# Altium project Kasli-SOC.PrjPcb (part 1 of 11)
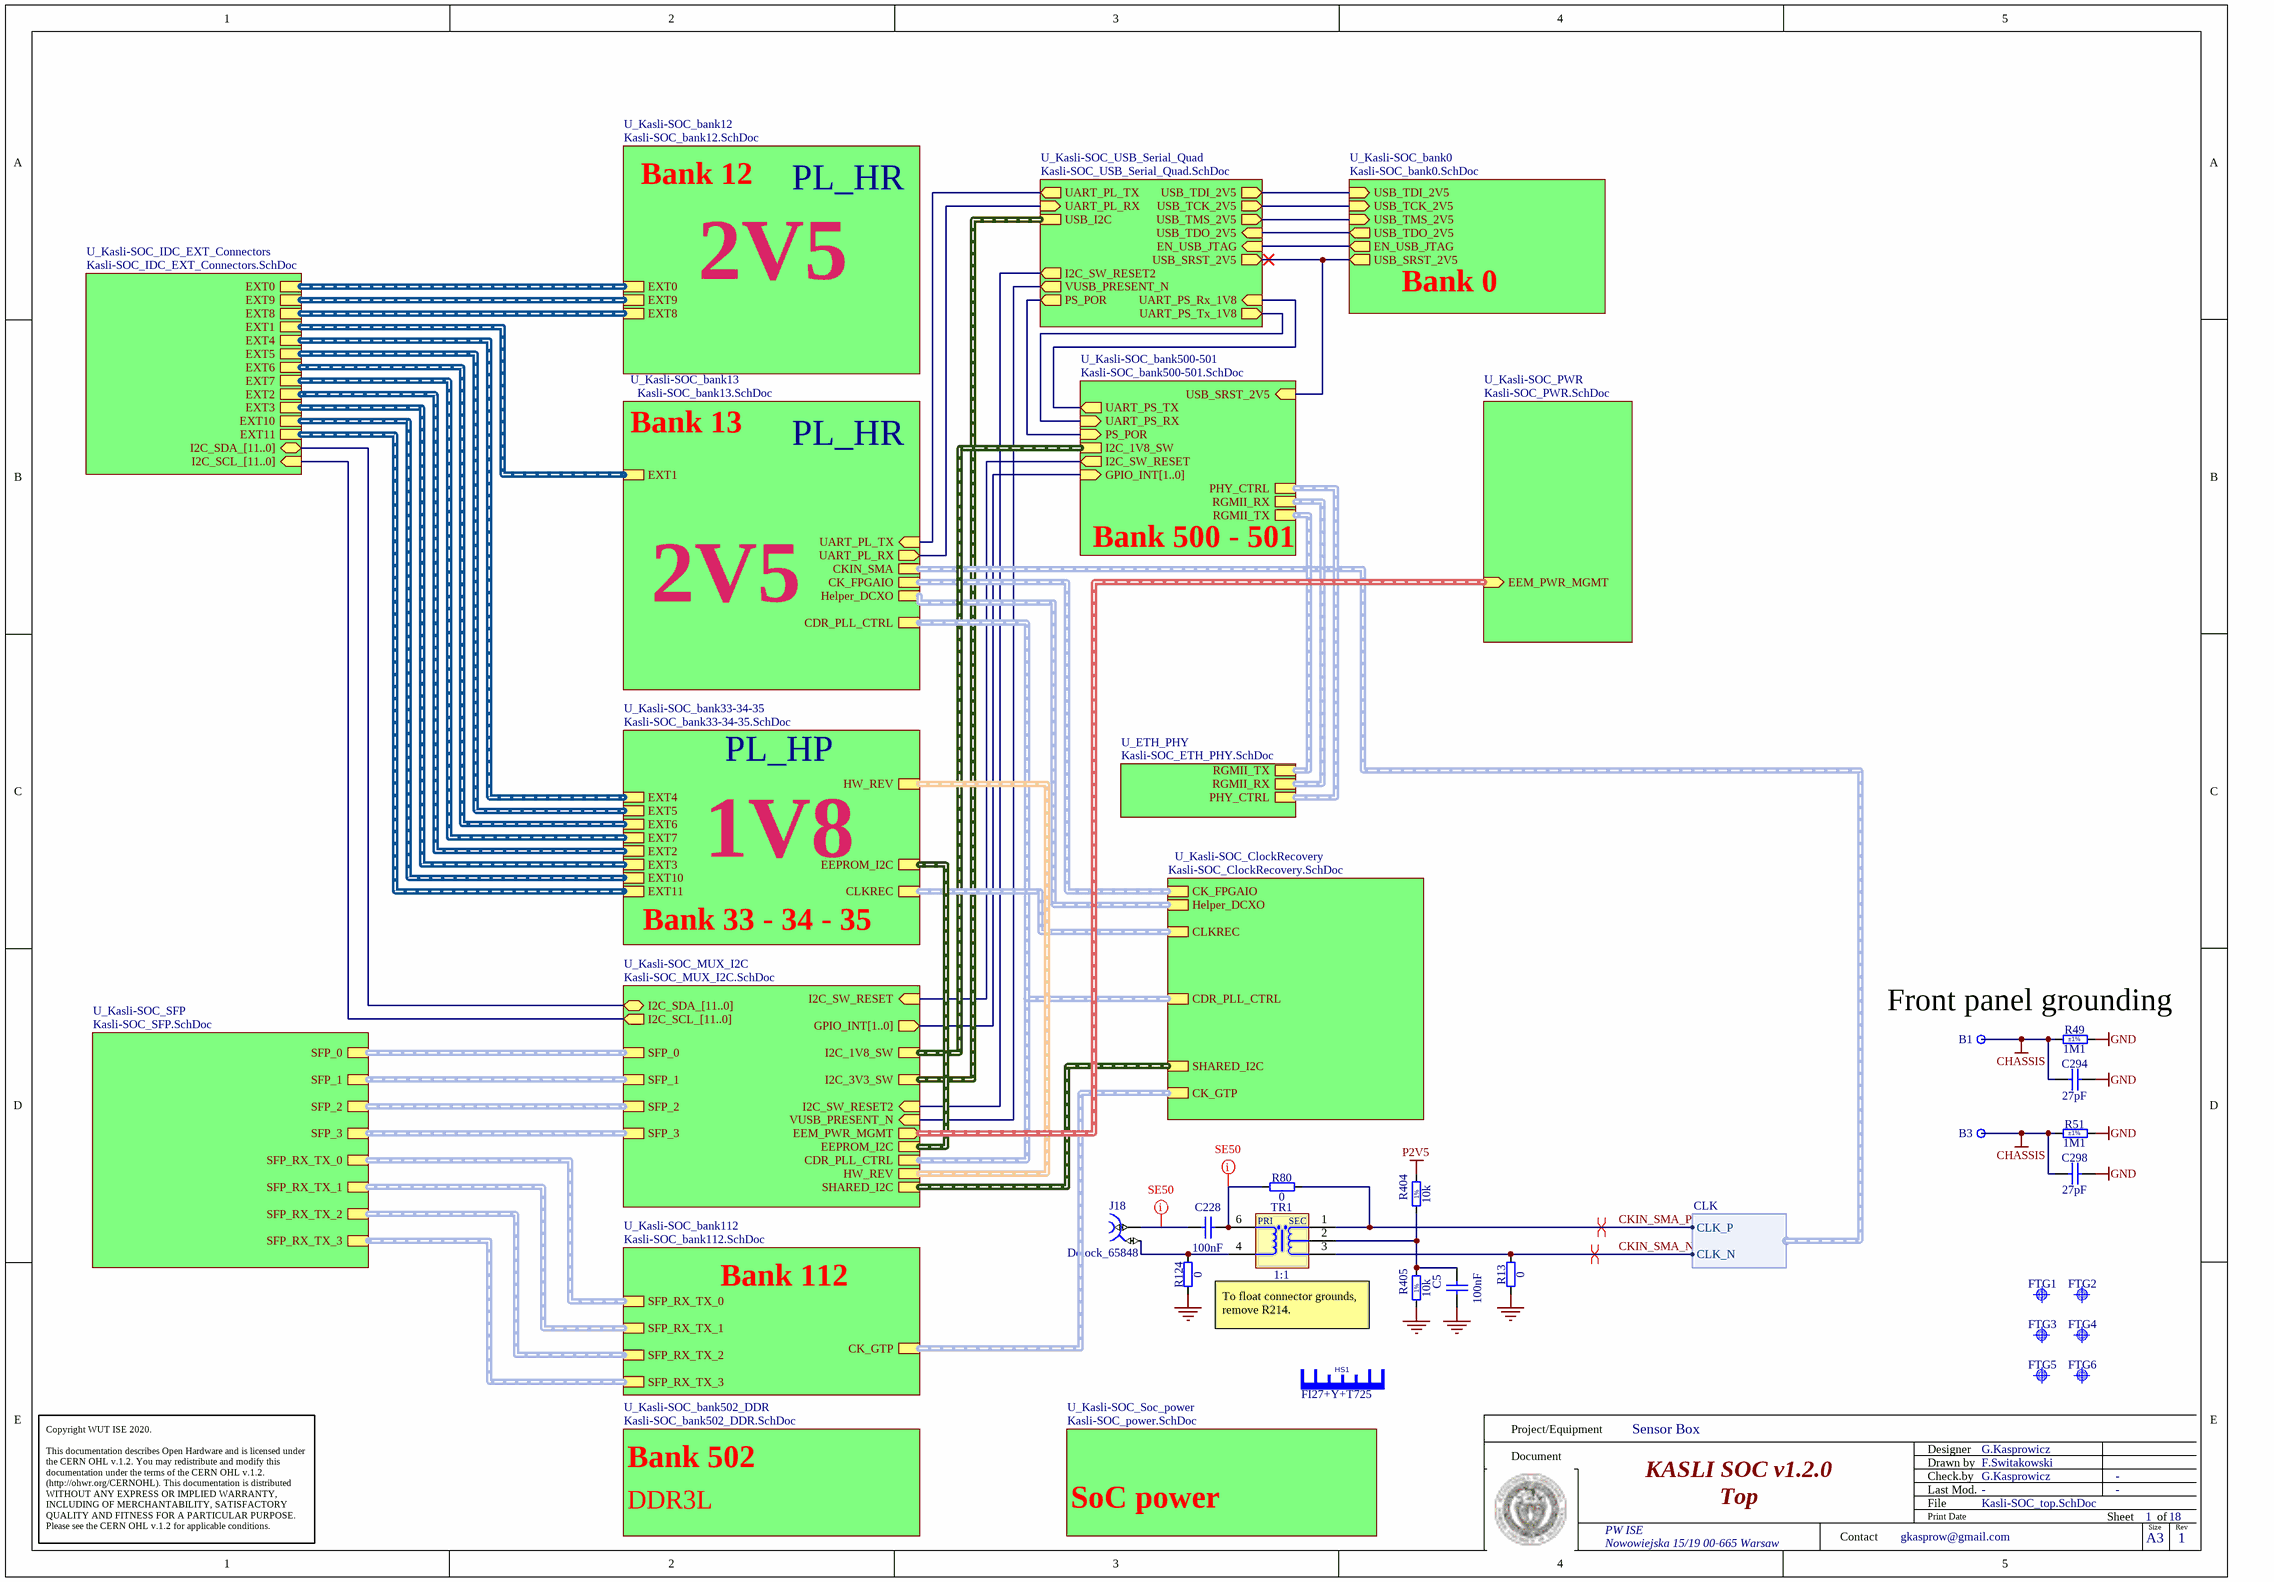
[diagram p0: Kasli-SOC_top.SchDoc]
P_version: 1.2.1
18 sheets, 964 parts. Net scope: hierarchical (ports join the sheet entries above them; power ports are global).
Board file: Kasli-SOC.PCBDOC
Sheets:
  Kasli-SOC_top.SchDoc
    U_Kasli-SOC_bank12 = Kasli-SOC_bank12.SchDoc
    U_Kasli-SOC_bank33-34-35 = Kasli-SOC_bank33-34-35.SchDoc
    U_Kasli-SOC_Soc_power = Kasli-SOC_power.SchDoc
    U_Kasli-SOC_bank112 = Kasli-SOC_bank112.SchDoc
    U_Kasli-SOC_bank500-501 = Kasli-SOC_bank500-501.SchDoc
    U_Kasli-SOC_bank502_DDR = Kasli-SOC_bank502_DDR.SchDoc
    U_Kasli-SOC_bank13 = Kasli-SOC_bank13.SchDoc
    U_Kasli-SOC_IDC_EXT_Connectors = Kasli-SOC_IDC_EXT_Connectors.SchDoc
    U_Kasli-SOC_SFP = Kasli-SOC_SFP.SchDoc
    U_Kasli-SOC_MUX_I2C = Kasli-SOC_MUX_I2C.SchDoc
    U_Kasli-SOC_ClockRecovery = Kasli-SOC_ClockRecovery.SchDoc
    U_Kasli-SOC_USB_Serial_Quad = Kasli-SOC_USB_Serial_Quad.SchDoc
    U_Kasli-SOC_PWR = Kasli-SOC_PWR.SchDoc
      U_Kasli_SOC_QUAD_BUCK = Kasli-SOC_QUAD_BUCK.SchDoc
      U_Kasli-SOC_linear = Kasli-SOC_linear.SchDoc
    U_Kasli-SOC_bank0 = Kasli-SOC_bank0.SchDoc
    U_ETH_PHY = Kasli-SOC_ETH_PHY.SchDoc

## Sheet Kasli-SOC_top.SchDoc: KASLI SOC v1.2.0
size 420 x 297 mm; Projet: FPGA & ARM SoC FMC Carrier; CheckedBy: G.Kasprowicz; Author: F.Switakowski; CompanyName: WUT ISE; DrawnBy: F.Switakowski; Organization: WUT ISE; Address1: PW ISE; Address2: Nowowiejska 15/19 00-665 Warsaw; Address3: gkasprow@gmail.com; DocumentNumber: 1; Revision: 1; SheetNumber: 1; SheetTotal: 18; ModifiedBy: -; CheckedDate: -; Title2: Top; DivGrp: WUT ISE; Designer: G.Kasprowicz; ModifiedDate: -; ProjectName: Sensor Box

### Parts
B1  Plated Hole  [MTG270_500]  (value not drawn)  (no BOM)
B3  Plated Hole  [MTG270_500]  (value not drawn)  (no BOM)
C5  100nF  [CAPC0603X33N]
C228  100nF  [CAPC0603X33N]
C294  27pF  [CAPC2012X135N]
C298  27pF  [CAPC2012X135N]
FTG1  Use only in PCB  [FIDUCIAL_TOP_S100-200]  (value not drawn)  (no BOM)
FTG2  Use only in PCB  [FIDUCIAL_TOP_S100-200]  (value not drawn)  (no BOM)
FTG3  Use only in PCB  [FIDUCIAL_TOP_S100-200]  (value not drawn)  (no BOM)
FTG4  Use only in PCB  [FIDUCIAL_TOP_S100-200]  (value not drawn)  (no BOM)
FTG5  Use only in PCB  [FIDUCIAL_TOP_S100-200]  (value not drawn)  (no BOM)
FTG6  Use only in PCB  [FIDUCIAL_TOP_S100-200]  (value not drawn)  (no BOM)
HS1  Manufacturer Part Number: FI27+Y+T725  (hidden comment: RADIAN_FI27+Y+T725)  (mechanical)
J18  Delock_65848  [Delock_65848]
R13  0  [RESC1005X40N]
R49  1M1  Tolerance: ±1%  [RESC1608X55N]
R51  1M1  Tolerance: ±1%  [RESC1608X55N]
R80  0  [RESC1005X40N]
R124  0  [RESC1005X40N]
R404  10k  [RESC1005X40N]
R405  10k  [RESC1005X40N]
TR1  1:1  [XFMR_MINI-CIRCUITS_AT1521]

### Sub-sheets
U_ETH_PHY = Kasli-SOC_ETH_PHY.SchDoc: RGMII_TX (harness RGMII), RGMII_RX (harness RGMII), PHY_CTRL (harness PHY_CTRL)
U_Kasli-SOC_bank0 = Kasli-SOC_bank0.SchDoc: USB_TDI_2V5 (in), USB_TCK_2V5 (in), USB_TMS_2V5 (in), USB_TDO_2V5 (out), EN_USB_JTAG (out), USB_SRST_2V5 (out)
U_Kasli-SOC_bank12 = Kasli-SOC_bank12.SchDoc: EXT0 (harness ExtensionConnector), EXT9 (harness ExtensionConnector), EXT8 (harness ExtensionConnector)
U_Kasli-SOC_bank13 = Kasli-SOC_bank13.SchDoc: CDR_PLL_CTRL (harness CDR_PLL_CTRL), EXT1 (harness ExtensionConnector), CK_FPGAIO (harness CLK), Helper_DCXO (harness CLK), CKIN_SMA (harness CLK), UART_PL_TX (in), UART_PL_RX (out)
U_Kasli-SOC_bank33-34-35 = Kasli-SOC_bank33-34-35.SchDoc: EXT6 (harness ExtensionConnector), EXT7 (harness ExtensionConnector), EXT2 (harness ExtensionConnector), EXT3 (harness ExtensionConnector), EXT10 (harness ExtensionConnector), EXT11 (harness ExtensionConnector), EXT5 (harness ExtensionConnector), EXT4 (harness ExtensionConnector), CLKREC (harness CLK), EEPROM_I2C (harness I2C), HW_REV (harness HW_REV)
U_Kasli-SOC_bank112 = Kasli-SOC_bank112.SchDoc: SFP_RX_TX_0 (harness SFP_RX_TX), SFP_RX_TX_1 (harness SFP_RX_TX), SFP_RX_TX_2 (harness SFP_RX_TX), SFP_RX_TX_3 (harness SFP_RX_TX), CK_GTP (harness CLK)
U_Kasli-SOC_bank500-501 = Kasli-SOC_bank500-501.SchDoc: UART_PS_RX (in), UART_PS_TX (out), PS_POR (in), USB_SRST_2V5 (in), GPIO_INT[1..0] (in), I2C_SW_RESET (out), I2C_1V8_SW (harness I2C), RGMII_RX (harness RGMII), RGMII_TX (harness RGMII), PHY_CTRL (harness PHY_CTRL)
U_Kasli-SOC_bank502_DDR = Kasli-SOC_bank502_DDR.SchDoc: no entries
U_Kasli-SOC_ClockRecovery = Kasli-SOC_ClockRecovery.SchDoc: CDR_PLL_CTRL (harness CDR_PLL_CTRL), SHARED_I2C (harness I2C), CK_GTP (harness CLK), CK_FPGAIO (harness CLK), Helper_DCXO (harness CLK), CLKREC (harness CLK)
U_Kasli-SOC_IDC_EXT_Connectors = Kasli-SOC_IDC_EXT_Connectors.SchDoc: EXT0 (harness ExtensionConnector), EXT4 (harness ExtensionConnector), EXT8 (harness ExtensionConnector), EXT9 (harness ExtensionConnector), EXT1 (harness ExtensionConnector), EXT7 (harness ExtensionConnector), EXT6 (harness ExtensionConnector), EXT5 (harness ExtensionConnector), EXT2 (harness ExtensionConnector), EXT3 (harness ExtensionConnector), EXT10 (harness ExtensionConnector), EXT11 (harness ExtensionConnector), I2C_SDA_[11..0] (bidir), I2C_SCL_[11..0] (in)
U_Kasli-SOC_MUX_I2C = Kasli-SOC_MUX_I2C.SchDoc: SFP_0 (harness SFP), SFP_1 (harness SFP), SFP_2 (harness SFP), SFP_3 (harness SFP), I2C_SW_RESET (in), I2C_SW_RESET2 (in), CDR_PLL_CTRL (harness CDR_PLL_CTRL), VUSB_PRESENT_N (in), GPIO_INT[1..0] (out), I2C_3V3_SW (harness I2C), I2C_1V8_SW (harness I2C), SHARED_I2C (harness I2C), I2C_SDA_[11..0] (bidir), I2C_SCL_[11..0] (out), EEPROM_I2C (harness I2C), HW_REV (harness HW_REV), EEM_PWR_MGMT (out)
U_Kasli-SOC_PWR = Kasli-SOC_PWR.SchDoc: EEM_PWR_MGMT (in)
U_Kasli-SOC_SFP = Kasli-SOC_SFP.SchDoc: SFP_RX_TX_0 (harness SFP_RX_TX), SFP_RX_TX_1 (harness SFP_RX_TX), SFP_RX_TX_2 (harness SFP_RX_TX), SFP_RX_TX_3 (harness SFP_RX_TX), SFP_0 (harness SFP), SFP_1 (harness SFP), SFP_2 (harness SFP), SFP_3 (harness SFP)
U_Kasli-SOC_Soc_power = Kasli-SOC_power.SchDoc: no entries
U_Kasli-SOC_USB_Serial_Quad = Kasli-SOC_USB_Serial_Quad.SchDoc: USB_TDI_2V5 (out), USB_TCK_2V5 (out), USB_TMS_2V5 (out), USB_TDO_2V5 (in), EN_USB_JTAG (in), I2C_SW_RESET2 (out), UART_PS_Rx_1V8 (in), UART_PS_Tx_1V8 (out), VUSB_PRESENT_N (out), USB_I2C (harness I2C), UART_PL_RX (in), UART_PL_TX (out), USB_SRST_2V5 (out), PS_POR (out)

### Harnesses
CLK: CLK_P, CLK_N

### Nets
CHASSIS: B1.1 B3.1 C294.1 C298.1 R49.1 R51.1
GND: C5.1 C294.2 C298.2 R13.1 R49.2 R51.2 R124.1 R405.1
P2V5: R404.2
CKIN_SMA_N: R13.2 TR1.3(S) ; sheet U_Kasli-SOC_bank13/CKIN_SMA.CLK_N
CKIN_SMA_P: R80.2 TR1.1(SDOT) ; sheet U_Kasli-SOC_bank13/CKIN_SMA.CLK_P
EN_USB_JTAG: sheet U_Kasli-SOC_USB_Serial_Quad/EN_USB_JTAG, sheet U_Kasli-SOC_bank0/EN_USB_JTAG
I2C_SW_RESET: sheet U_Kasli-SOC_bank500-501/I2C_SW_RESET, sheet U_Kasli-SOC_MUX_I2C/I2C_SW_RESET
I2C_SW_RESET2: sheet U_Kasli-SOC_MUX_I2C/I2C_SW_RESET2, sheet U_Kasli-SOC_USB_Serial_Quad/I2C_SW_RESET2
PS_POR: sheet U_Kasli-SOC_bank500-501/PS_POR, sheet U_Kasli-SOC_USB_Serial_Quad/PS_POR
UART_PL_RX: sheet U_Kasli-SOC_bank13/UART_PL_RX, sheet U_Kasli-SOC_USB_Serial_Quad/UART_PL_RX
UART_PL_TX: sheet U_Kasli-SOC_bank13/UART_PL_TX, sheet U_Kasli-SOC_USB_Serial_Quad/UART_PL_TX
UART_PS_RX: sheet U_Kasli-SOC_bank500-501/UART_PS_RX, sheet U_Kasli-SOC_USB_Serial_Quad/UART_PS_Tx_1V8
UART_PS_Rx_1V8: sheet U_Kasli-SOC_bank500-501/UART_PS_TX, sheet U_Kasli-SOC_USB_Serial_Quad/UART_PS_Rx_1V8
USB_SRST_2V5: sheet U_Kasli-SOC_bank500-501/USB_SRST_2V5, sheet U_Kasli-SOC_USB_Serial_Quad/USB_SRST_2V5, sheet U_Kasli-SOC_bank0/USB_SRST_2V5
USB_TCK_2V5: sheet U_Kasli-SOC_USB_Serial_Quad/USB_TCK_2V5, sheet U_Kasli-SOC_bank0/USB_TCK_2V5
USB_TDI_2V5: sheet U_Kasli-SOC_USB_Serial_Quad/USB_TDI_2V5, sheet U_Kasli-SOC_bank0/USB_TDI_2V5
USB_TDO_2V5: sheet U_Kasli-SOC_USB_Serial_Quad/USB_TDO_2V5, sheet U_Kasli-SOC_bank0/USB_TDO_2V5
USB_TMS_2V5: sheet U_Kasli-SOC_USB_Serial_Quad/USB_TMS_2V5, sheet U_Kasli-SOC_bank0/USB_TMS_2V5
VUSB_PRESENT_N: sheet U_Kasli-SOC_MUX_I2C/VUSB_PRESENT_N, sheet U_Kasli-SOC_USB_Serial_Quad/VUSB_PRESENT_N
NetC5_2: C5.2 R404.1 R405.2 TR1.2(NC)
NetC228_1: C228.1 J18.1
NetC228_2: C228.2 R80.1 TR1.6(PDOT)
NetJ18_2: J18.2 R124.2 TR1.4(P)

### Buses and harness runs
bus sheet U_Kasli-SOC_bank500-501/GPIO_INT[1..0] = sheet U_Kasli-SOC_MUX_I2C/GPIO_INT[1..0]
bus sheet U_Kasli-SOC_IDC_EXT_Connectors/I2C_SCL_[11..0] = sheet U_Kasli-SOC_MUX_I2C/I2C_SCL_[11..0]
bus sheet U_Kasli-SOC_IDC_EXT_Connectors/I2C_SDA_[11..0] = sheet U_Kasli-SOC_MUX_I2C/I2C_SDA_[11..0]
harness sheet U_ETH_PHY/PHY_CTRL = sheet U_Kasli-SOC_bank500-501/PHY_CTRL
harness sheet U_ETH_PHY/RGMII_RX = sheet U_Kasli-SOC_bank500-501/RGMII_RX
harness sheet U_ETH_PHY/RGMII_TX = sheet U_Kasli-SOC_bank500-501/RGMII_TX
harness sheet U_Kasli-SOC_bank12/EXT0 = sheet U_Kasli-SOC_IDC_EXT_Connectors/EXT0
harness sheet U_Kasli-SOC_bank12/EXT8 = sheet U_Kasli-SOC_IDC_EXT_Connectors/EXT8
harness sheet U_Kasli-SOC_bank12/EXT9 = sheet U_Kasli-SOC_IDC_EXT_Connectors/EXT9
harness sheet U_Kasli-SOC_bank13/CDR_PLL_CTRL = sheet U_Kasli-SOC_ClockRecovery/CDR_PLL_CTRL = sheet U_Kasli-SOC_MUX_I2C/CDR_PLL_CTRL
harness sheet U_Kasli-SOC_bank13/CK_FPGAIO = sheet U_Kasli-SOC_ClockRecovery/CK_FPGAIO
harness sheet U_Kasli-SOC_bank13/EXT1 = sheet U_Kasli-SOC_IDC_EXT_Connectors/EXT1
harness sheet U_Kasli-SOC_bank13/Helper_DCXO = sheet U_Kasli-SOC_ClockRecovery/Helper_DCXO
harness sheet U_Kasli-SOC_bank33-34-35/CLKREC = sheet U_Kasli-SOC_ClockRecovery/CLKREC
harness sheet U_Kasli-SOC_bank33-34-35/EEPROM_I2C = sheet U_Kasli-SOC_MUX_I2C/EEPROM_I2C
harness sheet U_Kasli-SOC_bank33-34-35/EXT2 = sheet U_Kasli-SOC_IDC_EXT_Connectors/EXT2
harness sheet U_Kasli-SOC_bank33-34-35/EXT3 = sheet U_Kasli-SOC_IDC_EXT_Connectors/EXT3
harness sheet U_Kasli-SOC_bank33-34-35/EXT4 = sheet U_Kasli-SOC_IDC_EXT_Connectors/EXT4
harness sheet U_Kasli-SOC_bank33-34-35/EXT5 = sheet U_Kasli-SOC_IDC_EXT_Connectors/EXT5
harness sheet U_Kasli-SOC_bank33-34-35/EXT6 = sheet U_Kasli-SOC_IDC_EXT_Connectors/EXT6
harness sheet U_Kasli-SOC_bank33-34-35/EXT7 = sheet U_Kasli-SOC_IDC_EXT_Connectors/EXT7
harness sheet U_Kasli-SOC_bank33-34-35/EXT10 = sheet U_Kasli-SOC_IDC_EXT_Connectors/EXT10
harness sheet U_Kasli-SOC_bank33-34-35/EXT11 = sheet U_Kasli-SOC_IDC_EXT_Connectors/EXT11
harness sheet U_Kasli-SOC_bank33-34-35/HW_REV = sheet U_Kasli-SOC_MUX_I2C/HW_REV
harness sheet U_Kasli-SOC_bank112/CK_GTP = sheet U_Kasli-SOC_ClockRecovery/CK_GTP
harness sheet U_Kasli-SOC_bank112/SFP_RX_TX_0 = sheet U_Kasli-SOC_SFP/SFP_RX_TX_0
harness sheet U_Kasli-SOC_bank112/SFP_RX_TX_1 = sheet U_Kasli-SOC_SFP/SFP_RX_TX_1
harness sheet U_Kasli-SOC_bank112/SFP_RX_TX_2 = sheet U_Kasli-SOC_SFP/SFP_RX_TX_2
harness sheet U_Kasli-SOC_bank112/SFP_RX_TX_3 = sheet U_Kasli-SOC_SFP/SFP_RX_TX_3
harness sheet U_Kasli-SOC_bank500-501/I2C_1V8_SW = sheet U_Kasli-SOC_MUX_I2C/I2C_1V8_SW
harness sheet U_Kasli-SOC_ClockRecovery/SHARED_I2C = sheet U_Kasli-SOC_MUX_I2C/SHARED_I2C
harness sheet U_Kasli-SOC_MUX_I2C/EEM_PWR_MGMT = sheet U_Kasli-SOC_PWR/EEM_PWR_MGMT
harness sheet U_Kasli-SOC_MUX_I2C/I2C_3V3_SW = sheet U_Kasli-SOC_USB_Serial_Quad/USB_I2C
harness sheet U_Kasli-SOC_MUX_I2C/SFP_0 = sheet U_Kasli-SOC_SFP/SFP_0
harness sheet U_Kasli-SOC_MUX_I2C/SFP_1 = sheet U_Kasli-SOC_SFP/SFP_1
harness sheet U_Kasli-SOC_MUX_I2C/SFP_2 = sheet U_Kasli-SOC_SFP/SFP_2
harness sheet U_Kasli-SOC_MUX_I2C/SFP_3 = sheet U_Kasli-SOC_SFP/SFP_3

### Layout directives
net class SE50: NetC228_1, NetC228_2
differential pair; differential pair class Diff_100Ohm: CKIN_SMA_N, CKIN_SMA_P

### Notes on the sheet
- Bank 12
- PL_HR
- 2V5
- Bank 0
- Bank 13
- Bank 500 - 501
- PL_HP
- 1V8
- Bank 33 - 34 - 35
- Front panel grounding
- Bank 112
- To float connector grounds, remove R214.
- Bank 502
- DDR3L
- SoC power
- Project/Equipment
- Document
- Designer
- Drawn by
- Check.by
- Copyright WUT ISE 2020.
  This documentation describes Open Hardware and is licensed under the CERN OHL v.1.2. You may redistribute and modify this documentation under the terms of the CERN OHL v.1.2. (http://ohwr.org/CERNOHL). This documentation is distributed WITHOUT ANY EXPRESS OR IMPLIED WARRANTY, INCLUDING OF MERCHANTABILITY, SATISFACTORY QUALITY AND FITNESS FOR A PARTICULAR PURPOSE. Please see the CERN OHL v.1.2 for applicable conditions.
- Contact
- File
- Last Mod.
- Print Date
- Sheet
- Size
- A3
- of
- Rev
- (in symbol R0402_10K_1%_0.0625W_100PPM) 1%
- (in symbol XFMR_MINI-CIRCUITS_TC2-1TX+) PRI; SEC

### Library data of the parts
B1 B3 = PLATED_HOLE2.7_PAD5.0: Single Terminal Socket; Part Description: Plated Through Hole: Hole Dia.=2.7mm Pad Dia.=5.0mm; Mounted: No; Part Number: PLATED_HOLE2.7_PAD5.0; Component Type: Standard (No BOM); Pin Count: 1; Family: Plated Hole; Socket: No; SMD: No; Sense: No; Status: None; ComponentHeight: 0mm; HelpURL: Undefined; Author: CERN DEM JMW; CreateDate: 27.09.2011; LatestRevisionDate: 27.09.2011; PackageDescription: Plated Through Hole: Hole Dia.=2.7mm Pad Dia.=5.0mm
C5 C228 = CC0201_100NF_6.3V_10%_X5R: Non-polarised capacitor; Part Description: SMD Multilayer Chip Ceramic Capacitor; Manufacturer: GENERIC; Manufacturer1 Part Number: 02016D104KAT2A; Voltage: 6.3V; TC: X5R; Tolerance: ±10%; Part Number: CC0201_100NF_6.3V_10%_X5R; Component Kind: Standard; Component Type: Standard; Pin Count: 2; Value: 100nF; Status: Not Recommended; Manufacturer Part Number: CC0201_100NF_6.3V_10%_X5R; Case: 0201; Mounted: Yes; Socket: No; SMD: Yes; Sense: No; Manufacturer1 Example: AVX; Manufacturer1 ComponentHeight: 0.33mm; HelpURL: \\cern.ch\dfs\Applications\Altium\Datasheets\CC0201_X5R_AVX.pdf; Author: CERN DEM JLC; CreateDate: 2007-12-03; LatestRevisionDate: 2007-12-03
C294 C298 = CC0805_27PF_50V_5%_NP0: Non-polarised capacitor; Part Description: SMD Multilayer Chip Ceramic Capacitor; Manufacturer: GENERIC; Manufacturer1 Part Number: 223886115279; Voltage: 50V; TC: C0G/NP0; Tolerance: ±5%; Part Number: CC0805_27PF_50V_5%_NP0; Component Kind: Standard; Component Type: Standard; Pin Count: 2; Value: 27pF; Status: Preferred; Manufacturer Part Number: CC0805_27PF_50V_5%_NP0; Case: 0805; Mounted: Yes; Socket: No; SMD: Yes; Sense: No; Manufacturer1 Example: PHYCOMP; Manufacturer1 ComponentHeight: 1.35mm; HelpURL: \\cern.ch\dfs\Applications\Altium\Datasheets\CC0805_NP0_PHYCOMP.pdf; Author: CERN DEM JLC; CreateDate: 12/3/2007; LatestRevisionDate: 12/3/2007
FTG1-FTG6 = FIDUCIAL_TARGET_S100-200: Fiducial Target; Part Description: Square Fiducial Target, Top Layer, 1.0mm, Top Solder 2.0mm, Keepout =2.0mm; Mounted: No; Part Number: FIDUCIAL_TARGET_S100-200; Component Type: Standard (No BOM); Pin Count: 1; Family: Fiducial; Socket: No; SMD: Yes; Sense: No; Status: None; ComponentHeight: 0mm; HelpURL: Undefined; Author: CERN DEM JLC; CreateDate: 09.02.2010; LatestRevisionDate: 04.04.2012; PackageDescription: Square Fiducial Target, Top Layer, 1.0mm, Top Solder 2.0mm, Keepout =2.0mm
HS1 = RADIAN_FI23: Heat Sink Without Pad; Manufacturer: Radian Thermal Products, Inc.; Part Description: 27 x 27 x 16 mm, clip on heatsink with fan for IC design BGA and others; ComponentHeight: 16 mm; HelpURL: https://www.radianheatsinks.com/product/fi23/
J18 = CMP-002-04652-1: SMA connector Delock 65848
R13 R80 R124 = R0402_0R_JUMPER: Resistor; Part Description: 1A (0.05R Max DC Resistance) Zero Ohm Jumper; Manufacturer: GENERIC; Manufacturer1 Part Number: 232270591001L; PressFit: No; Part Number: R0402_0R_JUMPER; Component Kind: Standard; Component Type: Standard; Pin Count: 2; Value: 0; Status: Not Recommended; Manufacturer Part Number: R0402_0R_JUMPER; Case: 0402; Mounted: Yes; Sense: No; Socket: No; SMD: Yes; Manufacturer1 Example: YAGEO PHYCOMP; Manufacturer1 ComponentHeight: 0.4mm; HelpURL: \\cern.ch\dfs\Applications\Altium\Datasheets\R0402_Phycomp_RC0402.pdf; Author: CERN DEM JLC; CreateDate: 03.12.2007; LatestRevisionDate: 17.10.2012
R49 R51 = R0603_1M1_1%_0.1W_100PPM: Resistor - 1%; Part Description: General Purpose Thick Film Chip Resistor; Manufacturer: GENERIC; Manufacturer1 Part Number: NRC06F1104TRF; Power: 0.1W; TC: ±100ppm/°C; PressFit: No; Part Number: R0603_1M1_1%_0.1W_100PPM; Component Kind: Standard; Component Type: Standard; Pin Count: 2; Value: 1M1; Status: Preferred; Manufacturer Part Number: R0603_1M1_1%_0.1W_100PPM; Case: 0603; Mounted: Yes; Sense: No; Socket: No; SMD: Yes; Manufacturer1 Example: NIC COMPONENT; Manufacturer1 ComponentHeight: 0.55mm; HelpURL: \\cern.ch\dfs\Applications\Altium\Datasheets\R0603_NIC_NRC.pdf; Author: CERN DEM JLC; CreateDate: 12/3/2007; LatestRevisionDate: 3/13/2008
R404 R405 = R0402_10K_1%_0.0625W_100PPM: Resistor - 1%; Part Description: General Purpose Thick Film Chip Resistor; Manufacturer: GENERIC; Manufacturer1 Part Number: 232270671003L; TC: ±100ppm/°C; PressFit: No; Part Number: R0402_10K_1%_0.0625W_100PPM; Component Kind: Standard; Component Type: Standard; Pin Count: 2; Value: 10k; Status: Not Recommended; Power: 0.0625W; Tolerance: ±1%; Manufacturer Part Number: R0402_10K_1%_0.0625W_100PPM; Case: 0402; Mounted: Yes; Sense: No; Socket: No; SMD: Yes; Manufacturer1 Example: YAGEO PHYCOMP; Manufacturer1 ComponentHeight: 0.4mm; HelpURL: \\cern.ch\dfs\Applications\Altium\Datasheets\R0402_Phycomp_RC0402.pdf; Author: CERN DEM JLC; CreateDate: 03.12.2007; LatestRevisionDate: 17.10.2012
TR1 = XFMR_MINI-CIRCUITS_TC2-1TX+: 50 Ohms 3 to 300MHz RF Transformer; Part Number: XFMR_MINI-CIRCUITS_TC2-1TX+; Component Kind: Standard; Component Type: Standard; Pin Count: 5; Value: 1:1; Status: None; Part Description: 50 Ohms 3 to 300MHz RF Transformer; Manufacturer: MINI-CIRCUITS; Manufacturer Part Number: TC2-1TX+; Mounted: Yes; Socket: No; Sense: No; SMD: Yes; ComponentHeight: 4.06mm; HelpURL: \\cern.ch\dfs\Applications\Altium\Datasheets\XFMR_MINI-CIRCUITS_TC2-1TX+.pdf; Author: CERN DEM MR; CreateDate: 18.10.2019; LatestRevisionDate: 18.10.2019

## Sheet Kasli-SOC_bank12.SchDoc: Bank12
size 420 x 297 mm; CheckedBy: G.Kasprowicz; Author: F.Switakowski; CompanyName: WUT ISE; DrawnBy: F.Switakowski; Organization: WUT ISE; Address1: PW ISE; Address2: Nowowiejska 15/19 00-665 Warsaw; Address3: gkasprow@gmail.com; DocumentNumber: 6; Revision: 1; SheetNumber: 6; SheetTotal: 18; ModifiedBy: -; CheckedDate: -; Title2: EEM LVDS; DivGrp: WUT ISE; Designer: G.Kasprowicz; ModifiedDate: -; ProjectName: Sensor Box
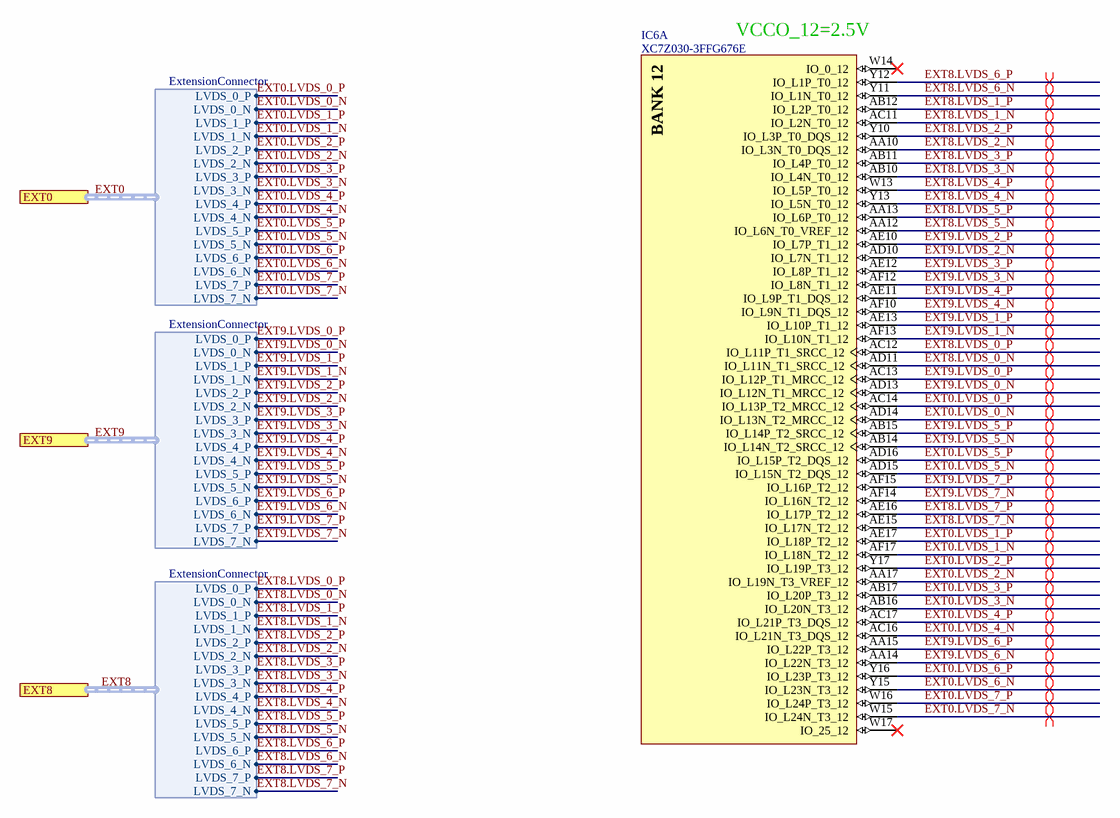
[diagram p1: Kasli-SOC_bank12.SchDoc]

### Parts
IC6  XC7Z030-3FFG676E  [BGA676C100P26X26_2700X2700X324]  (part A of 14)

### Ports
EXT0 (harness ExtensionConnector), EXT8 (harness ExtensionConnector), EXT9 (harness ExtensionConnector)

### Harnesses
ExtensionConnector: LVDS_0_N, LVDS_0_P, LVDS_1_N, LVDS_1_P, LVDS_2_N, LVDS_2_P, LVDS_3_N, LVDS_3_P, LVDS_4_N, LVDS_4_P, LVDS_5_N, LVDS_5_P, LVDS_6_N, LVDS_6_P, LVDS_7_N, LVDS_7_P

### Nets
EXT0.LVDS_0_N: IC6.AD14(IO_L13N_T2_MRCC_12) ; port EXT0.LVDS_0_N
EXT0.LVDS_0_P: IC6.AC14(IO_L13P_T2_MRCC_12) ; port EXT0.LVDS_0_P
EXT0.LVDS_1_N: IC6.AF17(IO_L18N_T2_12) ; port EXT0.LVDS_1_N
EXT0.LVDS_1_P: IC6.AE17(IO_L18P_T2_12) ; port EXT0.LVDS_1_P
EXT0.LVDS_2_N: IC6.AA17(IO_L19N_T3_VREF_12) ; port EXT0.LVDS_2_N
EXT0.LVDS_2_P: IC6.Y17(IO_L19P_T3_12) ; port EXT0.LVDS_2_P
EXT0.LVDS_3_N: IC6.AB16(IO_L20N_T3_12) ; port EXT0.LVDS_3_N
EXT0.LVDS_3_P: IC6.AB17(IO_L20P_T3_12) ; port EXT0.LVDS_3_P
EXT0.LVDS_4_N: IC6.AC16(IO_L21N_T3_DQS_12) ; port EXT0.LVDS_4_N
EXT0.LVDS_4_P: IC6.AC17(IO_L21P_T3_DQS_12) ; port EXT0.LVDS_4_P
EXT0.LVDS_5_N: IC6.AD15(IO_L15N_T2_DQS_12) ; port EXT0.LVDS_5_N
EXT0.LVDS_5_P: IC6.AD16(IO_L15P_T2_DQS_12) ; port EXT0.LVDS_5_P
EXT0.LVDS_6_N: IC6.Y15(IO_L23N_T3_12) ; port EXT0.LVDS_6_N
EXT0.LVDS_6_P: IC6.Y16(IO_L23P_T3_12) ; port EXT0.LVDS_6_P
EXT0.LVDS_7_N: IC6.W15(IO_L24N_T3_12) ; port EXT0.LVDS_7_N
EXT0.LVDS_7_P: IC6.W16(IO_L24P_T3_12) ; port EXT0.LVDS_7_P
EXT8.LVDS_0_N: IC6.AD11(IO_L11N_T1_SRCC_12) ; port EXT8.LVDS_0_N
EXT8.LVDS_0_P: IC6.AC12(IO_L11P_T1_SRCC_12) ; port EXT8.LVDS_0_P
EXT8.LVDS_1_N: IC6.AC11(IO_L2N_T0_12) ; port EXT8.LVDS_1_N
EXT8.LVDS_1_P: IC6.AB12(IO_L2P_T0_12) ; port EXT8.LVDS_1_P
EXT8.LVDS_2_N: IC6.AA10(IO_L3N_T0_DQS_12) ; port EXT8.LVDS_2_N
EXT8.LVDS_2_P: IC6.Y10(IO_L3P_T0_DQS_12) ; port EXT8.LVDS_2_P
EXT8.LVDS_3_N: IC6.AB10(IO_L4N_T0_12) ; port EXT8.LVDS_3_N
EXT8.LVDS_3_P: IC6.AB11(IO_L4P_T0_12) ; port EXT8.LVDS_3_P
EXT8.LVDS_4_N: IC6.Y13(IO_L5N_T0_12) ; port EXT8.LVDS_4_N
EXT8.LVDS_4_P: IC6.W13(IO_L5P_T0_12) ; port EXT8.LVDS_4_P
EXT8.LVDS_5_N: IC6.AA12(IO_L6N_T0_VREF_12) ; port EXT8.LVDS_5_N
EXT8.LVDS_5_P: IC6.AA13(IO_L6P_T0_12) ; port EXT8.LVDS_5_P
EXT8.LVDS_6_N: IC6.Y11(IO_L1N_T0_12) ; port EXT8.LVDS_6_N
EXT8.LVDS_6_P: IC6.Y12(IO_L1P_T0_12) ; port EXT8.LVDS_6_P
EXT8.LVDS_7_N: IC6.AE15(IO_L17N_T2_12) ; port EXT8.LVDS_7_N
EXT8.LVDS_7_P: IC6.AE16(IO_L17P_T2_12) ; port EXT8.LVDS_7_P
EXT9.LVDS_0_N: IC6.AD13(IO_L12N_T1_MRCC_12) ; port EXT9.LVDS_0_N
EXT9.LVDS_0_P: IC6.AC13(IO_L12P_T1_MRCC_12) ; port EXT9.LVDS_0_P
EXT9.LVDS_1_N: IC6.AF13(IO_L10N_T1_12) ; port EXT9.LVDS_1_N
EXT9.LVDS_1_P: IC6.AE13(IO_L10P_T1_12) ; port EXT9.LVDS_1_P
EXT9.LVDS_2_N: IC6.AD10(IO_L7N_T1_12) ; port EXT9.LVDS_2_N
EXT9.LVDS_2_P: IC6.AE10(IO_L7P_T1_12) ; port EXT9.LVDS_2_P
EXT9.LVDS_3_N: IC6.AF12(IO_L8N_T1_12) ; port EXT9.LVDS_3_N
EXT9.LVDS_3_P: IC6.AE12(IO_L8P_T1_12) ; port EXT9.LVDS_3_P
EXT9.LVDS_4_N: IC6.AF10(IO_L9N_T1_DQS_12) ; port EXT9.LVDS_4_N
EXT9.LVDS_4_P: IC6.AE11(IO_L9P_T1_DQS_12) ; port EXT9.LVDS_4_P
EXT9.LVDS_5_N: IC6.AB14(IO_L14N_T2_SRCC_12) ; port EXT9.LVDS_5_N
EXT9.LVDS_5_P: IC6.AB15(IO_L14P_T2_SRCC_12) ; port EXT9.LVDS_5_P
EXT9.LVDS_6_N: IC6.AA14(IO_L22N_T3_12) ; port EXT9.LVDS_6_N
EXT9.LVDS_6_P: IC6.AA15(IO_L22P_T3_12) ; port EXT9.LVDS_6_P
EXT9.LVDS_7_N: IC6.AF14(IO_L16N_T2_12) ; port EXT9.LVDS_7_N
EXT9.LVDS_7_P: IC6.AF15(IO_L16P_T2_12) ; port EXT9.LVDS_7_P

Not connected (* = marked no-connect by the designer): IC6 W14(IO_0_12)* W17(IO_25_12)*

### Buses and harness runs
harness EXT0 = port EXT0
harness EXT8 = port EXT8
harness EXT9 = port EXT9

### Layout directives
differential pair: EXT0.LVDS_0_N, EXT0.LVDS_0_P, EXT0.LVDS_1_N, EXT0.LVDS_1_P, EXT0.LVDS_2_N, EXT0.LVDS_2_P, EXT0.LVDS_3_N, EXT0.LVDS_3_P, EXT0.LVDS_4_N, EXT0.LVDS_4_P, EXT0.LVDS_5_N, EXT0.LVDS_5_P, EXT0.LVDS_6_N, EXT0.LVDS_6_P, EXT0.LVDS_7_N, EXT0.LVDS_7_P, EXT8.LVDS_0_N, EXT8.LVDS_0_P, EXT8.LVDS_1_N, EXT8.LVDS_1_P, EXT8.LVDS_2_N, EXT8.LVDS_2_P, EXT8.LVDS_3_N, EXT8.LVDS_3_P, EXT8.LVDS_4_N, EXT8.LVDS_4_P, EXT8.LVDS_5_N, EXT8.LVDS_5_P, EXT8.LVDS_6_N, EXT8.LVDS_6_P, EXT8.LVDS_7_N, EXT8.LVDS_7_P, EXT9.LVDS_0_N, EXT9.LVDS_0_P, EXT9.LVDS_1_N, EXT9.LVDS_1_P, EXT9.LVDS_2_N, EXT9.LVDS_2_P, EXT9.LVDS_3_N, EXT9.LVDS_3_P, EXT9.LVDS_4_N, EXT9.LVDS_4_P, EXT9.LVDS_5_N, EXT9.LVDS_5_P, EXT9.LVDS_6_N, EXT9.LVDS_6_P, EXT9.LVDS_7_N, EXT9.LVDS_7_P

### Notes on the sheet
- (near IC6) VCCO_12=2.5V
- Project/Equipment
- Document
- Designer
- Drawn by
- Check.by
- Copyright WUT ISE 2020.
  This documentation describes Open Hardware and is licensed under the CERN OHL v.1.2. You may redistribute and modify this documentation under the terms of the CERN OHL v.1.2. (http://ohwr.org/CERNOHL). This documentation is distributed WITHOUT ANY EXPRESS OR IMPLIED WARRANTY, INCLUDING OF MERCHANTABILITY, SATISFACTORY QUALITY AND FITNESS FOR A PARTICULAR PURPOSE. Please see the CERN OHL v.1.2 for applicable conditions.
- Contact
- File
- Last Mod.
- Print Date
- Sheet
- Size
- A3
- of
- Rev
- (in symbol XC7Z030-2FFG676I, part A) BANK 12

### Library data of the parts
IC6 = XC7Z030-2FFG676I: 733 MHz Zynq™-7000 AP SoC, 130 PS I/O, 254 FPGA I/O, 676-Ball BGA, Speed Grade 2, Industrial Grade, Pb-Free; Part Description: Zynq™-7000 All Programmable SoC, Dual-core ARM® Cortex™-A9 CPU, 676-Ball BGA, Speed Grade 2, Industrial Grade, Pb-Free; Manufacturer: XILINX; PressFit: No; Bonding: No; Part Number: XC7Z030-3FFG676E; Component Kind: Standard; Component Type: Standard; Device: XC7Z030-2FFG676I; PackageDescription: BGA, 1.00mm Pitch, Square; 676 Pin, 26 Columns X 26 Rows, 27.00mm X 27.00mm X 2.60mm H; Manufacturer Part Number: XC7Z030-3FFG676E; Pin Count: 676; Case: BGA676; Mounted: Yes; Socket: No; SMD: Yes; Sense: No; ComponentHeight: 3.24mm; HelpURL: \\cern.ch\dfs\Applications\Altium\Datasheets\XC7Z030-2FFG676I.pdf; ComponentLink1URL: \\cern.ch\dfs\Applications\Altium\Datasheets\XC7Z030-2FFG676I_Package.pdf; ComponentLink1Description: Package; ComponentLink2URL: \\cern.ch\dfs\Applications\Altium\Datasheets\XC7Z030-2FFG676I_Pinout.txt; ComponentLink2Description: Pinout; Author: CERN DEM JLC; CreateDate: 29/04/2014; LatestRevisionDate: 29/04/2014

## Sheet Kasli-SOC_bank33-34-35.SchDoc: Banks 33, 34, 35
size 420 x 297 mm; EDA_Number: EDA-03288-V3-0; CheckedBy: G.Kasprowicz; Author: F.Switakowski; CompanyName: WUT ISE; DrawnBy: F.Switakowski; Organization: WUT ISE; Address1: PW ISE; Address2: Nowowiejska 15/19 00-665 Warsaw; Address3: gkasprow@gmail.com; DocumentNumber: 7; Revision: 1; SheetNumber: 7; SheetTotal: 18; ModifiedBy: -; CheckedDate: -; Title2: EEM LVDS; DivGrp: WUT ISE; Designer: G.Kasprowicz; ModifiedDate: -; ProjectName: Sensor Box
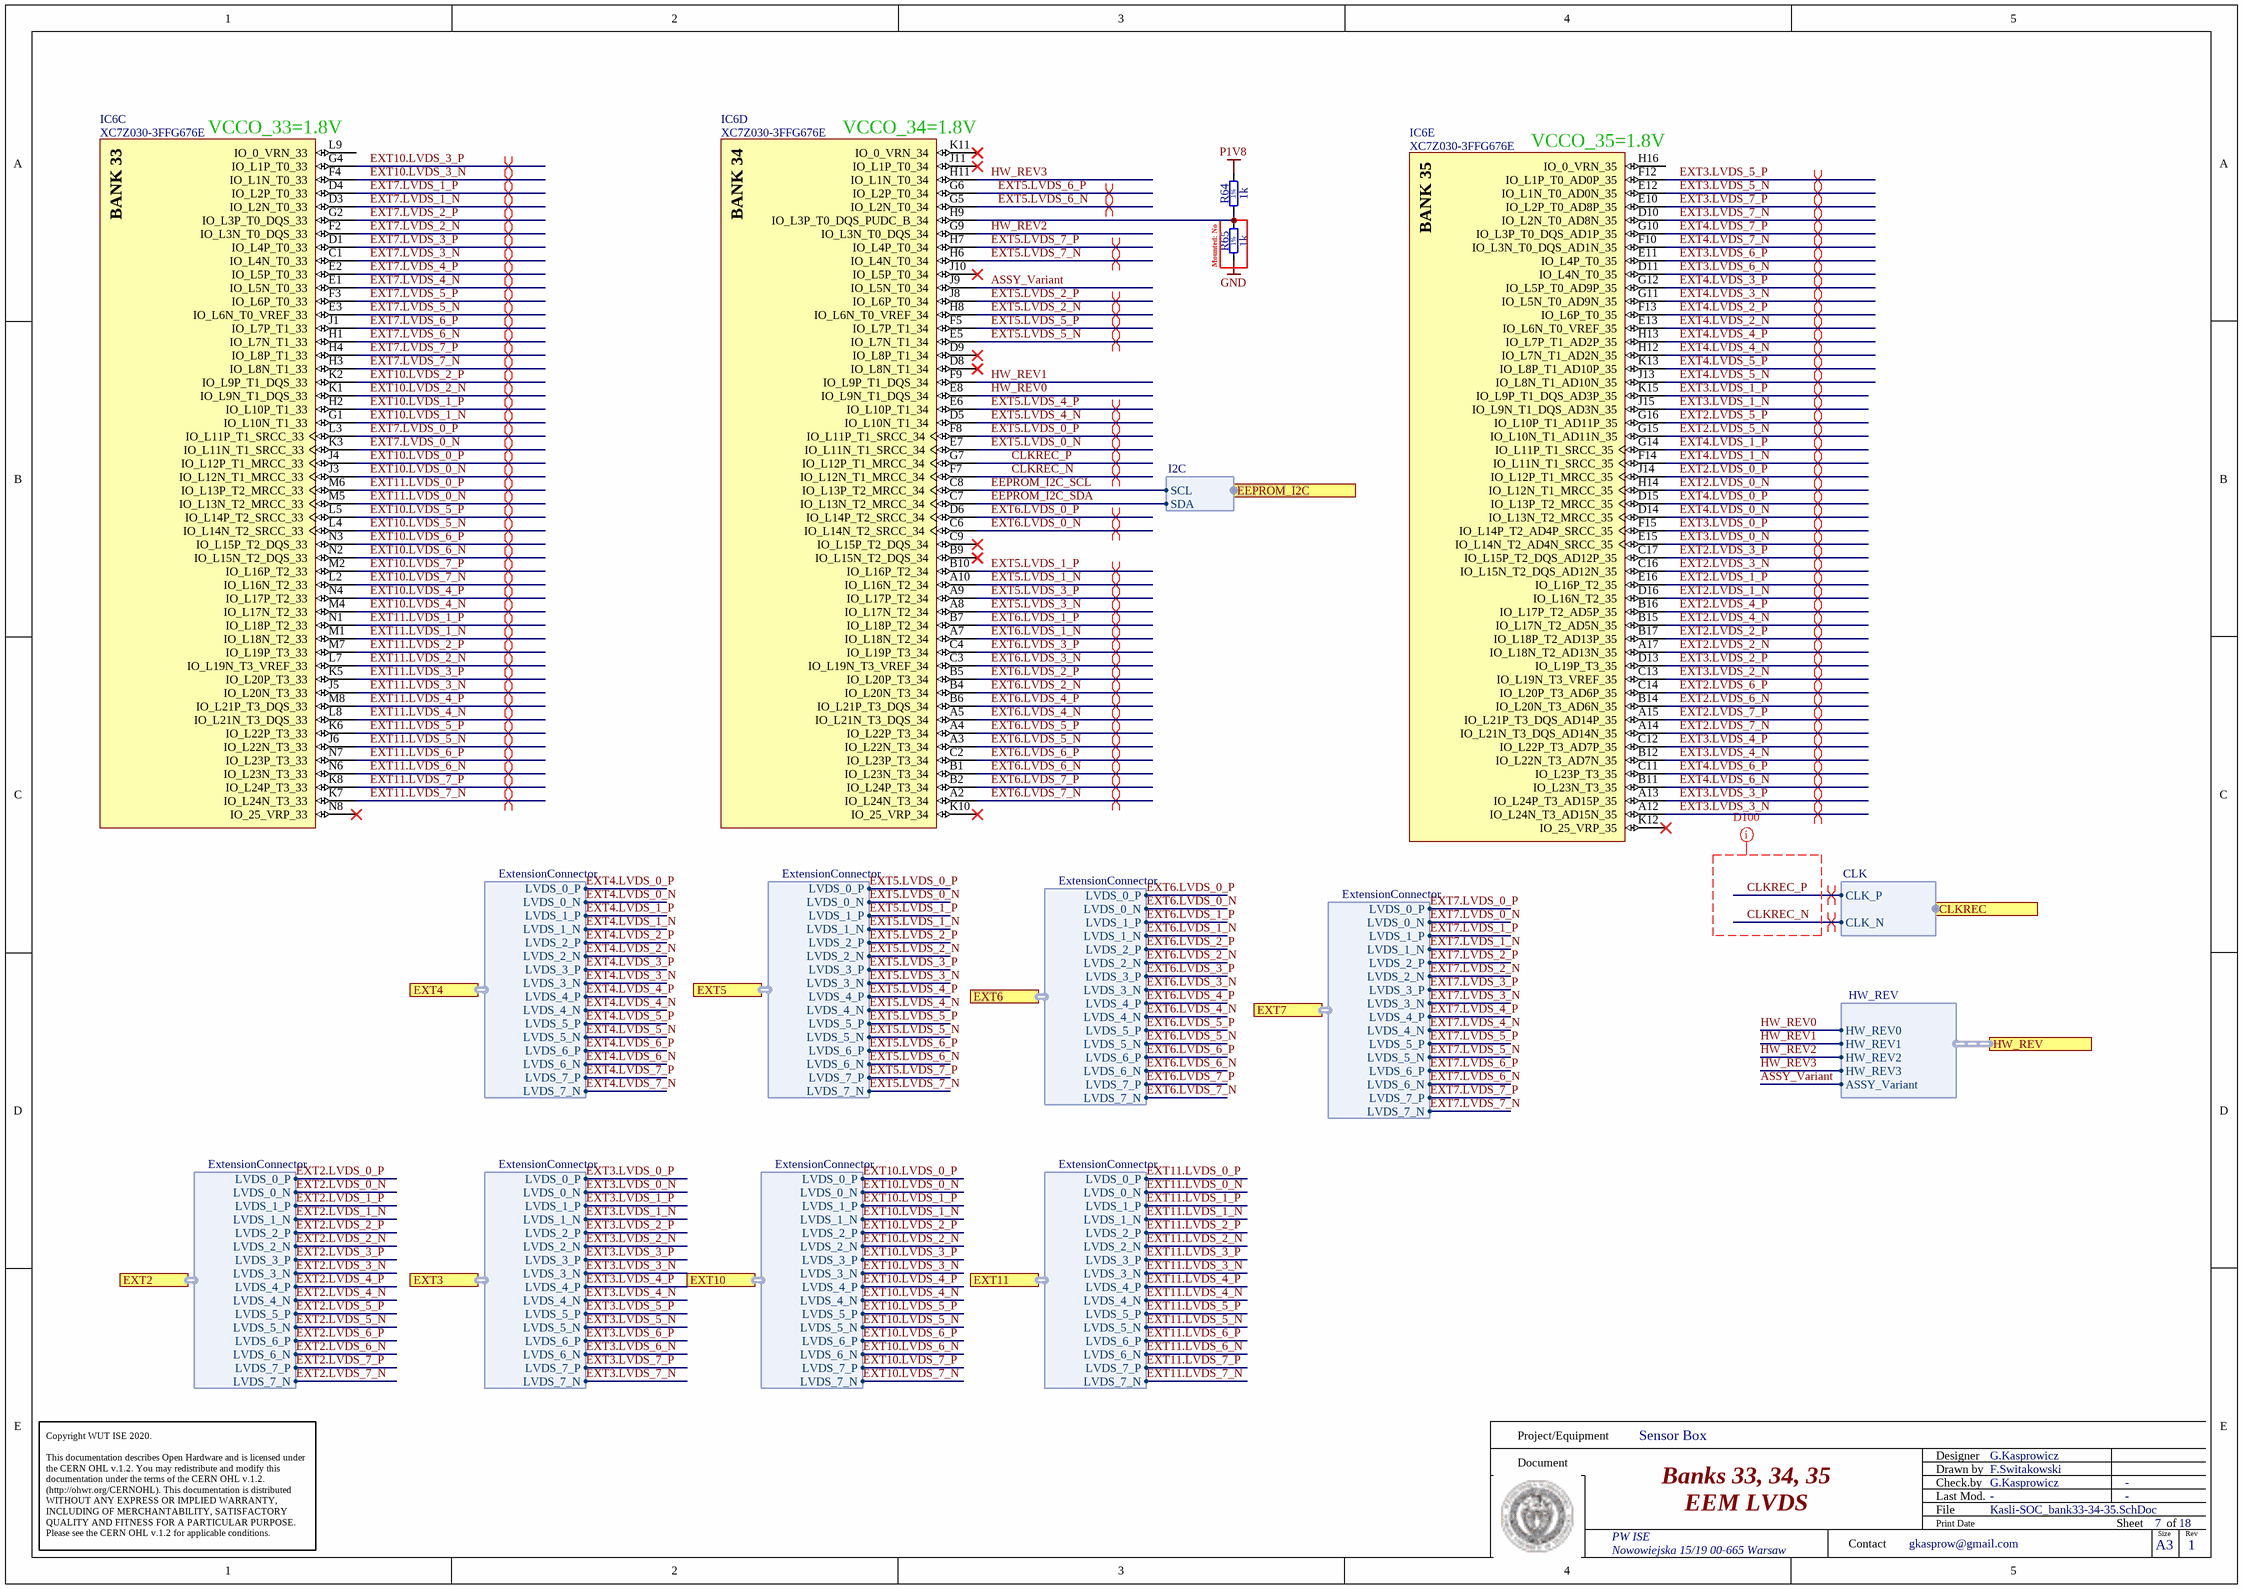
[diagram p2: Kasli-SOC_bank33-34-35.SchDoc]

### Parts
IC6  XC7Z030-3FFG676E  [BGA676C100P26X26_2700X2700X324]  (parts C,D,E of 14)
R64  1k  [RESC1005X40N]
R65  1k  [RESC1005X40N]

### Ports
CLKREC (harness CLK), EEPROM_I2C (harness I2C), EXT2 (harness ExtensionConnector), EXT3 (harness ExtensionConnector), EXT4 (harness ExtensionConnector), EXT5 (harness ExtensionConnector), EXT6 (harness ExtensionConnector), EXT7 (harness ExtensionConnector), EXT10 (harness ExtensionConnector), EXT11 (harness ExtensionConnector), HW_REV (harness HW_REV)

### Harnesses
ExtensionConnector: LVDS_0_N, LVDS_0_P, LVDS_1_N, LVDS_1_P, LVDS_2_N, LVDS_2_P, LVDS_3_N, LVDS_3_P, LVDS_4_N, LVDS_4_P, LVDS_5_N, LVDS_5_P, LVDS_6_N, LVDS_6_P, LVDS_7_N, LVDS_7_P
CLK: CLK_P, CLK_N
I2C: SDA, SCL
HW_REV: ASSY_Variant, HW_REV3, HW_REV2, HW_REV1, HW_REV0

### Nets
GND: R65.1
P1V8: R64.2
ASSY_Variant: IC6.J9(IO_L5N_T0_34) ; port HW_REV.ASSY_Variant
CLKREC_N: IC6.F7(IO_L12N_T1_MRCC_34) ; port CLKREC.CLK_N
CLKREC_P: IC6.G7(IO_L12P_T1_MRCC_34) ; port CLKREC.CLK_P
EEPROM_I2C_SCL: IC6.C8(IO_L13P_T2_MRCC_34) ; port EEPROM_I2C.SCL
EEPROM_I2C_SDA: IC6.C7(IO_L13N_T2_MRCC_34) ; port EEPROM_I2C.SDA
EXT2.LVDS_0_N: IC6.H14(IO_L12N_T1_MRCC_35) ; port EXT2.LVDS_0_N
EXT2.LVDS_0_P: IC6.J14(IO_L12P_T1_MRCC_35) ; port EXT2.LVDS_0_P
EXT2.LVDS_1_N: IC6.D16(IO_L16N_T2_35) ; port EXT2.LVDS_1_N
EXT2.LVDS_1_P: IC6.E16(IO_L16P_T2_35) ; port EXT2.LVDS_1_P
EXT2.LVDS_2_N: IC6.A17(IO_L18N_T2_AD13N_35) ; port EXT2.LVDS_2_N
EXT2.LVDS_2_P: IC6.B17(IO_L18P_T2_AD13P_35) ; port EXT2.LVDS_2_P
EXT2.LVDS_3_N: IC6.C16(IO_L15N_T2_DQS_AD12N_35) ; port EXT2.LVDS_3_N
EXT2.LVDS_3_P: IC6.C17(IO_L15P_T2_DQS_AD12P_35) ; port EXT2.LVDS_3_P
EXT2.LVDS_4_N: IC6.B15(IO_L17N_T2_AD5N_35) ; port EXT2.LVDS_4_N
EXT2.LVDS_4_P: IC6.B16(IO_L17P_T2_AD5P_35) ; port EXT2.LVDS_4_P
EXT2.LVDS_5_N: IC6.G15(IO_L10N_T1_AD11N_35) ; port EXT2.LVDS_5_N
EXT2.LVDS_5_P: IC6.G16(IO_L10P_T1_AD11P_35) ; port EXT2.LVDS_5_P
EXT2.LVDS_6_N: IC6.B14(IO_L20N_T3_AD6N_35) ; port EXT2.LVDS_6_N
EXT2.LVDS_6_P: IC6.C14(IO_L20P_T3_AD6P_35) ; port EXT2.LVDS_6_P
EXT2.LVDS_7_N: IC6.A14(IO_L21N_T3_DQS_AD14N_35) ; port EXT2.LVDS_7_N
EXT2.LVDS_7_P: IC6.A15(IO_L21P_T3_DQS_AD14P_35) ; port EXT2.LVDS_7_P
EXT3.LVDS_0_N: IC6.E15(IO_L14N_T2_AD4N_SRCC_35) ; port EXT3.LVDS_0_N
EXT3.LVDS_0_P: IC6.F15(IO_L14P_T2_AD4P_SRCC_35) ; port EXT3.LVDS_0_P
EXT3.LVDS_1_N: IC6.J15(IO_L9N_T1_DQS_AD3N_35) ; port EXT3.LVDS_1_N
EXT3.LVDS_1_P: IC6.K15(IO_L9P_T1_DQS_AD3P_35) ; port EXT3.LVDS_1_P
EXT3.LVDS_2_N: IC6.C13(IO_L19N_T3_VREF_35) ; port EXT3.LVDS_2_N
EXT3.LVDS_2_P: IC6.D13(IO_L19P_T3_35) ; port EXT3.LVDS_2_P
EXT3.LVDS_3_N: IC6.A12(IO_L24N_T3_AD15N_35) ; port EXT3.LVDS_3_N
EXT3.LVDS_3_P: IC6.A13(IO_L24P_T3_AD15P_35) ; port EXT3.LVDS_3_P
EXT3.LVDS_4_N: IC6.B12(IO_L22N_T3_AD7N_35) ; port EXT3.LVDS_4_N
EXT3.LVDS_4_P: IC6.C12(IO_L22P_T3_AD7P_35) ; port EXT3.LVDS_4_P
EXT3.LVDS_5_N: IC6.E12(IO_L1N_T0_AD0N_35) ; port EXT3.LVDS_5_N
EXT3.LVDS_5_P: IC6.F12(IO_L1P_T0_AD0P_35) ; port EXT3.LVDS_5_P
EXT3.LVDS_6_N: IC6.D11(IO_L4N_T0_35) ; port EXT3.LVDS_6_N
EXT3.LVDS_6_P: IC6.E11(IO_L4P_T0_35) ; port EXT3.LVDS_6_P
EXT3.LVDS_7_N: IC6.D10(IO_L2N_T0_AD8N_35) ; port EXT3.LVDS_7_N
EXT3.LVDS_7_P: IC6.E10(IO_L2P_T0_AD8P_35) ; port EXT3.LVDS_7_P
EXT4.LVDS_0_N: IC6.D14(IO_L13N_T2_MRCC_35) ; port EXT4.LVDS_0_N
EXT4.LVDS_0_P: IC6.D15(IO_L13P_T2_MRCC_35) ; port EXT4.LVDS_0_P
EXT4.LVDS_1_N: IC6.F14(IO_L11N_T1_SRCC_35) ; port EXT4.LVDS_1_N
EXT4.LVDS_1_P: IC6.G14(IO_L11P_T1_SRCC_35) ; port EXT4.LVDS_1_P
EXT4.LVDS_2_N: IC6.E13(IO_L6N_T0_VREF_35) ; port EXT4.LVDS_2_N
EXT4.LVDS_2_P: IC6.F13(IO_L6P_T0_35) ; port EXT4.LVDS_2_P
EXT4.LVDS_3_N: IC6.G11(IO_L5N_T0_AD9N_35) ; port EXT4.LVDS_3_N
EXT4.LVDS_3_P: IC6.G12(IO_L5P_T0_AD9P_35) ; port EXT4.LVDS_3_P
EXT4.LVDS_4_N: IC6.H12(IO_L7N_T1_AD2N_35) ; port EXT4.LVDS_4_N
EXT4.LVDS_4_P: IC6.H13(IO_L7P_T1_AD2P_35) ; port EXT4.LVDS_4_P
EXT4.LVDS_5_N: IC6.J13(IO_L8N_T1_AD10N_35) ; port EXT4.LVDS_5_N
EXT4.LVDS_5_P: IC6.K13(IO_L8P_T1_AD10P_35) ; port EXT4.LVDS_5_P
EXT4.LVDS_6_N: IC6.B11(IO_L23N_T3_35) ; port EXT4.LVDS_6_N
EXT4.LVDS_6_P: IC6.C11(IO_L23P_T3_35) ; port EXT4.LVDS_6_P
EXT4.LVDS_7_N: IC6.F10(IO_L3N_T0_DQS_AD1N_35) ; port EXT4.LVDS_7_N
EXT4.LVDS_7_P: IC6.G10(IO_L3P_T0_DQS_AD1P_35) ; port EXT4.LVDS_7_P
EXT5.LVDS_0_N: IC6.E7(IO_L11N_T1_SRCC_34) ; port EXT5.LVDS_0_N
EXT5.LVDS_0_P: IC6.F8(IO_L11P_T1_SRCC_34) ; port EXT5.LVDS_0_P
EXT5.LVDS_1_N: IC6.A10(IO_L16N_T2_34) ; port EXT5.LVDS_1_N
EXT5.LVDS_1_P: IC6.B10(IO_L16P_T2_34) ; port EXT5.LVDS_1_P
EXT5.LVDS_2_N: IC6.H8(IO_L6N_T0_VREF_34) ; port EXT5.LVDS_2_N
EXT5.LVDS_2_P: IC6.J8(IO_L6P_T0_34) ; port EXT5.LVDS_2_P
EXT5.LVDS_3_N: IC6.A8(IO_L17N_T2_34) ; port EXT5.LVDS_3_N
EXT5.LVDS_3_P: IC6.A9(IO_L17P_T2_34) ; port EXT5.LVDS_3_P
EXT5.LVDS_4_N: IC6.D5(IO_L10N_T1_34) ; port EXT5.LVDS_4_N
EXT5.LVDS_4_P: IC6.E6(IO_L10P_T1_34) ; port EXT5.LVDS_4_P
EXT5.LVDS_5_N: IC6.E5(IO_L7N_T1_34) ; port EXT5.LVDS_5_N
EXT5.LVDS_5_P: IC6.F5(IO_L7P_T1_34) ; port EXT5.LVDS_5_P
EXT5.LVDS_6_N: IC6.G5(IO_L2N_T0_34) ; port EXT5.LVDS_6_N
EXT5.LVDS_6_P: IC6.G6(IO_L2P_T0_34) ; port EXT5.LVDS_6_P
EXT5.LVDS_7_N: IC6.H6(IO_L4N_T0_34) ; port EXT5.LVDS_7_N
EXT5.LVDS_7_P: IC6.H7(IO_L4P_T0_34) ; port EXT5.LVDS_7_P
EXT6.LVDS_0_N: IC6.C6(IO_L14N_T2_SRCC_34) ; port EXT6.LVDS_0_N
EXT6.LVDS_0_P: IC6.D6(IO_L14P_T2_SRCC_34) ; port EXT6.LVDS_0_P
EXT6.LVDS_1_N: IC6.A7(IO_L18N_T2_34) ; port EXT6.LVDS_1_N
EXT6.LVDS_1_P: IC6.B7(IO_L18P_T2_34) ; port EXT6.LVDS_1_P
EXT6.LVDS_2_N: IC6.B4(IO_L20N_T3_34) ; port EXT6.LVDS_2_N
EXT6.LVDS_2_P: IC6.B5(IO_L20P_T3_34) ; port EXT6.LVDS_2_P
EXT6.LVDS_3_N: IC6.C3(IO_L19N_T3_VREF_34) ; port EXT6.LVDS_3_N
EXT6.LVDS_3_P: IC6.C4(IO_L19P_T3_34) ; port EXT6.LVDS_3_P
EXT6.LVDS_4_N: IC6.A5(IO_L21N_T3_DQS_34) ; port EXT6.LVDS_4_N
EXT6.LVDS_4_P: IC6.B6(IO_L21P_T3_DQS_34) ; port EXT6.LVDS_4_P
EXT6.LVDS_5_N: IC6.A3(IO_L22N_T3_34) ; port EXT6.LVDS_5_N
EXT6.LVDS_5_P: IC6.A4(IO_L22P_T3_34) ; port EXT6.LVDS_5_P
EXT6.LVDS_6_N: IC6.B1(IO_L23N_T3_34) ; port EXT6.LVDS_6_N
EXT6.LVDS_6_P: IC6.C2(IO_L23P_T3_34) ; port EXT6.LVDS_6_P
EXT6.LVDS_7_N: IC6.A2(IO_L24N_T3_34) ; port EXT6.LVDS_7_N
EXT6.LVDS_7_P: IC6.B2(IO_L24P_T3_34) ; port EXT6.LVDS_7_P
EXT7.LVDS_0_N: IC6.K3(IO_L11N_T1_SRCC_33) ; port EXT7.LVDS_0_N
EXT7.LVDS_0_P: IC6.L3(IO_L11P_T1_SRCC_33) ; port EXT7.LVDS_0_P
EXT7.LVDS_1_N: IC6.D3(IO_L2N_T0_33) ; port EXT7.LVDS_1_N
EXT7.LVDS_1_P: IC6.D4(IO_L2P_T0_33) ; port EXT7.LVDS_1_P
EXT7.LVDS_2_N: IC6.F2(IO_L3N_T0_DQS_33) ; port EXT7.LVDS_2_N
EXT7.LVDS_2_P: IC6.G2(IO_L3P_T0_DQS_33) ; port EXT7.LVDS_2_P
EXT7.LVDS_3_N: IC6.C1(IO_L4N_T0_33) ; port EXT7.LVDS_3_N
EXT7.LVDS_3_P: IC6.D1(IO_L4P_T0_33) ; port EXT7.LVDS_3_P
EXT7.LVDS_4_N: IC6.E1(IO_L5N_T0_33) ; port EXT7.LVDS_4_N
EXT7.LVDS_4_P: IC6.E2(IO_L5P_T0_33) ; port EXT7.LVDS_4_P
EXT7.LVDS_5_N: IC6.E3(IO_L6N_T0_VREF_33) ; port EXT7.LVDS_5_N
EXT7.LVDS_5_P: IC6.F3(IO_L6P_T0_33) ; port EXT7.LVDS_5_P
EXT7.LVDS_6_N: IC6.H1(IO_L7N_T1_33) ; port EXT7.LVDS_6_N
EXT7.LVDS_6_P: IC6.J1(IO_L7P_T1_33) ; port EXT7.LVDS_6_P
EXT7.LVDS_7_N: IC6.H3(IO_L8N_T1_33) ; port EXT7.LVDS_7_N
EXT7.LVDS_7_P: IC6.H4(IO_L8P_T1_33) ; port EXT7.LVDS_7_P
EXT10.LVDS_0_N: IC6.J3(IO_L12N_T1_MRCC_33) ; port EXT10.LVDS_0_N
EXT10.LVDS_0_P: IC6.J4(IO_L12P_T1_MRCC_33) ; port EXT10.LVDS_0_P
EXT10.LVDS_1_N: IC6.G1(IO_L10N_T1_33) ; port EXT10.LVDS_1_N
EXT10.LVDS_1_P: IC6.H2(IO_L10P_T1_33) ; port EXT10.LVDS_1_P
EXT10.LVDS_2_N: IC6.K1(IO_L9N_T1_DQS_33) ; port EXT10.LVDS_2_N
EXT10.LVDS_2_P: IC6.K2(IO_L9P_T1_DQS_33) ; port EXT10.LVDS_2_P
EXT10.LVDS_3_N: IC6.F4(IO_L1N_T0_33) ; port EXT10.LVDS_3_N
EXT10.LVDS_3_P: IC6.G4(IO_L1P_T0_33) ; port EXT10.LVDS_3_P
EXT10.LVDS_4_N: IC6.M4(IO_L17N_T2_33) ; port EXT10.LVDS_4_N
EXT10.LVDS_4_P: IC6.N4(IO_L17P_T2_33) ; port EXT10.LVDS_4_P
EXT10.LVDS_5_N: IC6.L4(IO_L14N_T2_SRCC_33) ; port EXT10.LVDS_5_N
EXT10.LVDS_5_P: IC6.L5(IO_L14P_T2_SRCC_33) ; port EXT10.LVDS_5_P
EXT10.LVDS_6_N: IC6.N2(IO_L15N_T2_DQS_33) ; port EXT10.LVDS_6_N
EXT10.LVDS_6_P: IC6.N3(IO_L15P_T2_DQS_33) ; port EXT10.LVDS_6_P
EXT10.LVDS_7_N: IC6.L2(IO_L16N_T2_33) ; port EXT10.LVDS_7_N
EXT10.LVDS_7_P: IC6.M2(IO_L16P_T2_33) ; port EXT10.LVDS_7_P
EXT11.LVDS_0_N: IC6.M5(IO_L13N_T2_MRCC_33) ; port EXT11.LVDS_0_N
EXT11.LVDS_0_P: IC6.M6(IO_L13P_T2_MRCC_33) ; port EXT11.LVDS_0_P
EXT11.LVDS_1_N: IC6.M1(IO_L18N_T2_33) ; port EXT11.LVDS_1_N
EXT11.LVDS_1_P: IC6.N1(IO_L18P_T2_33) ; port EXT11.LVDS_1_P
EXT11.LVDS_2_N: IC6.L7(IO_L19N_T3_VREF_33) ; port EXT11.LVDS_2_N
EXT11.LVDS_2_P: IC6.M7(IO_L19P_T3_33) ; port EXT11.LVDS_2_P
EXT11.LVDS_3_N: IC6.J5(IO_L20N_T3_33) ; port EXT11.LVDS_3_N
EXT11.LVDS_3_P: IC6.K5(IO_L20P_T3_33) ; port EXT11.LVDS_3_P
EXT11.LVDS_4_N: IC6.L8(IO_L21N_T3_DQS_33) ; port EXT11.LVDS_4_N
EXT11.LVDS_4_P: IC6.M8(IO_L21P_T3_DQS_33) ; port EXT11.LVDS_4_P
EXT11.LVDS_5_N: IC6.J6(IO_L22N_T3_33) ; port EXT11.LVDS_5_N
EXT11.LVDS_5_P: IC6.K6(IO_L22P_T3_33) ; port EXT11.LVDS_5_P
EXT11.LVDS_6_N: IC6.N6(IO_L23N_T3_33) ; port EXT11.LVDS_6_N
EXT11.LVDS_6_P: IC6.N7(IO_L23P_T3_33) ; port EXT11.LVDS_6_P
EXT11.LVDS_7_N: IC6.K7(IO_L24N_T3_33) ; port EXT11.LVDS_7_N
EXT11.LVDS_7_P: IC6.K8(IO_L24P_T3_33) ; port EXT11.LVDS_7_P
HW_REV0: IC6.E8(IO_L9N_T1_DQS_34) ; port HW_REV.HW_REV0
HW_REV1: IC6.F9(IO_L9P_T1_DQS_34) ; port HW_REV.HW_REV1
HW_REV2: IC6.G9(IO_L3N_T0_DQS_34) ; port HW_REV.HW_REV2
HW_REV3: IC6.H11(IO_L1N_T0_34) ; port HW_REV.HW_REV3
NetIC6_H9: IC6.H9(IO_L3P_T0_DQS_PUDC_B_34) R64.1 R65.2

Not connected (* = marked no-connect by the designer): IC6 B9(IO_L15N_T2_DQS_34)* C9(IO_L15P_T2_DQS_34)* D8(IO_L8N_T1_34)* D9(IO_L8P_T1_34)* H16(IO_0_VRN_35) J10(IO_L5P_T0_34)* J11(IO_L1P_T0_34)* K10(IO_25_VRP_34)* K11(IO_0_VRN_34)* K12(IO_25_VRP_35)* L9(IO_0_VRN_33) N8(IO_25_VRP_33)*

### Layout directives
differential pair: CLKREC_N, CLKREC_P, EXT2.LVDS_0_N, EXT2.LVDS_0_P, EXT2.LVDS_1_N, EXT2.LVDS_1_P, EXT2.LVDS_2_N, EXT2.LVDS_2_P, EXT2.LVDS_3_N, EXT2.LVDS_3_P, EXT2.LVDS_4_N, EXT2.LVDS_4_P, EXT2.LVDS_5_N, EXT2.LVDS_5_P, EXT2.LVDS_6_N, EXT2.LVDS_6_P, EXT2.LVDS_7_N, EXT2.LVDS_7_P, EXT3.LVDS_0_N, EXT3.LVDS_0_P, EXT3.LVDS_1_N, EXT3.LVDS_1_P, EXT3.LVDS_2_N, EXT3.LVDS_2_P, EXT3.LVDS_3_N, EXT3.LVDS_3_P, EXT3.LVDS_4_N, EXT3.LVDS_4_P, EXT3.LVDS_5_N, EXT3.LVDS_5_P, EXT3.LVDS_6_N, EXT3.LVDS_6_P, EXT3.LVDS_7_N, EXT3.LVDS_7_P, EXT4.LVDS_0_N, EXT4.LVDS_0_P, EXT4.LVDS_1_N, EXT4.LVDS_1_P, EXT4.LVDS_2_N, EXT4.LVDS_2_P, EXT4.LVDS_3_N, EXT4.LVDS_3_P, EXT4.LVDS_4_N, EXT4.LVDS_4_P, EXT4.LVDS_5_N, EXT4.LVDS_5_P, EXT4.LVDS_6_N, EXT4.LVDS_6_P, EXT4.LVDS_7_N, EXT4.LVDS_7_P, EXT5.LVDS_0_N, EXT5.LVDS_0_P, EXT5.LVDS_1_N, EXT5.LVDS_1_P, EXT5.LVDS_2_N, EXT5.LVDS_2_P, EXT5.LVDS_3_N, EXT5.LVDS_3_P, EXT5.LVDS_4_N, EXT5.LVDS_4_P, EXT5.LVDS_5_N, EXT5.LVDS_5_P, EXT5.LVDS_6_N, EXT5.LVDS_6_P, EXT5.LVDS_7_N, EXT5.LVDS_7_P, EXT6.LVDS_0_N, EXT6.LVDS_0_P, EXT6.LVDS_1_N, EXT6.LVDS_1_P, EXT6.LVDS_2_N, EXT6.LVDS_2_P, EXT6.LVDS_3_N, EXT6.LVDS_3_P, EXT6.LVDS_4_N, EXT6.LVDS_4_P, EXT6.LVDS_5_N, EXT6.LVDS_5_P, EXT6.LVDS_6_N, EXT6.LVDS_6_P, EXT6.LVDS_7_N, EXT6.LVDS_7_P, EXT7.LVDS_0_N, EXT7.LVDS_0_P, EXT7.LVDS_1_N, EXT7.LVDS_1_P, EXT7.LVDS_2_N, EXT7.LVDS_2_P, EXT7.LVDS_3_N, EXT7.LVDS_3_P, EXT7.LVDS_4_N, EXT7.LVDS_4_P, EXT7.LVDS_5_N, EXT7.LVDS_5_P, EXT7.LVDS_6_N, EXT7.LVDS_6_P, EXT7.LVDS_7_N, EXT7.LVDS_7_P, EXT10.LVDS_0_N, EXT10.LVDS_0_P, EXT10.LVDS_1_N, EXT10.LVDS_1_P, EXT10.LVDS_2_N, EXT10.LVDS_2_P, EXT10.LVDS_3_N, EXT10.LVDS_3_P, EXT10.LVDS_4_N, EXT10.LVDS_4_P, EXT10.LVDS_5_N, EXT10.LVDS_5_P, EXT10.LVDS_6_N, EXT10.LVDS_6_P, EXT10.LVDS_7_N, EXT10.LVDS_7_P, EXT11.LVDS_0_N, EXT11.LVDS_0_P, EXT11.LVDS_1_N, EXT11.LVDS_1_P, EXT11.LVDS_2_N, EXT11.LVDS_2_P, EXT11.LVDS_3_N, EXT11.LVDS_3_P, EXT11.LVDS_4_N, EXT11.LVDS_4_P, EXT11.LVDS_5_N, EXT11.LVDS_5_P, EXT11.LVDS_6_N, EXT11.LVDS_6_P, EXT11.LVDS_7_N, EXT11.LVDS_7_P
net class D100: CLKREC_N, CLKREC_P

### Notes on the sheet
- (near IC6) VCCO_33=1.8V
- (near IC6) VCCO_34=1.8V
- (near IC6) VCCO_35=1.8V
- (near R65) Mounted: No
- Project/Equipment
- Document
- Designer
- Drawn by
- Check.by
- Copyright WUT ISE 2020.
  This documentation describes Open Hardware and is licensed under the CERN OHL v.1.2. You may redistribute and modify this documentation under the terms of the CERN OHL v.1.2. (http://ohwr.org/CERNOHL). This documentation is distributed WITHOUT ANY EXPRESS OR IMPLIED WARRANTY, INCLUDING OF MERCHANTABILITY, SATISFACTORY QUALITY AND FITNESS FOR A PARTICULAR PURPOSE. Please see the CERN OHL v.1.2 for applicable conditions.
- Contact
- File
- Last Mod.
- Print Date
- Sheet
- Size
- A3
- of
- Rev
- (in symbol R0402_1K_1%_0.0625W_100PPM) 1%
- (in symbol XC7Z030-2FFG676I, part C) BANK 33
- (in symbol XC7Z030-2FFG676I, part D) BANK 34
- (in symbol XC7Z030-2FFG676I, part E) BANK 35

### Library data of the parts
IC6 = XC7Z030-2FFG676I: as IC6 on sheet Kasli-SOC_bank12; Part Number: XC7Z030-3FFG676E; Component Kind: Standard; Component Type: Standard; Device: XC7Z030-2FFG676I; PackageDescription: BGA, 1.00mm Pitch, Square; 676 Pin, 26 Columns X 26 Rows, 27.00mm X 27.00mm X 2.60mm H; Manufacturer Part Number: XC7Z030-3FFG676E; Pin Count: 676; Case: BGA676; Mounted: Yes; Socket: No; SMD: Yes; Sense: No; ComponentHeight: 3.24mm; HelpURL: \\cern.ch\dfs\Applications\Altium\Datasheets\XC7Z030-2FFG676I.pdf; ComponentLink1URL: \\cern.ch\dfs\Applications\Altium\Datasheets\XC7Z030-2FFG676I_Package.pdf; ComponentLink1Description: Package; ComponentLink2URL: \\cern.ch\dfs\Applications\Altium\Datasheets\XC7Z030-2FFG676I_Pinout.txt; ComponentLink2Description: Pinout; Author: CERN DEM JLC; CreateDate: 29/04/2014; LatestRevisionDate: 29/04/2014
R64 R65 = R0402_1K_1%_0.0625W_100PPM: Resistor - 1%; Part Description: General Purpose Thick Film Chip Resistor; Manufacturer: GENERIC; Manufacturer1 Part Number: 232270671002L; TC: ±100ppm/°C; PressFit: No; Part Number: R0402_1K_1%_0.0625W_100PPM; Component Kind: Standard; Component Type: Standard; Pin Count: 2; Value: 1k; Status: Not Recommended; Power: 0.0625W; Tolerance: ±1%; Manufacturer Part Number: R0402_1K_1%_0.0625W_100PPM; Case: 0402; Mounted: Yes; Sense: No; Socket: No; SMD: Yes; Manufacturer1 Example: YAGEO PHYCOMP; Manufacturer1 ComponentHeight: 0.4mm; HelpURL: \\cern.ch\dfs\Applications\Altium\Datasheets\R0402_Phycomp_RC0402.pdf; Author: CERN DEM JLC; CreateDate: 03.12.2007; LatestRevisionDate: 17.10.2012